# EAGLE design EAGLE_PCB_Design_Project1.1_DavidSalzmann (EAGLE 9.6.2)
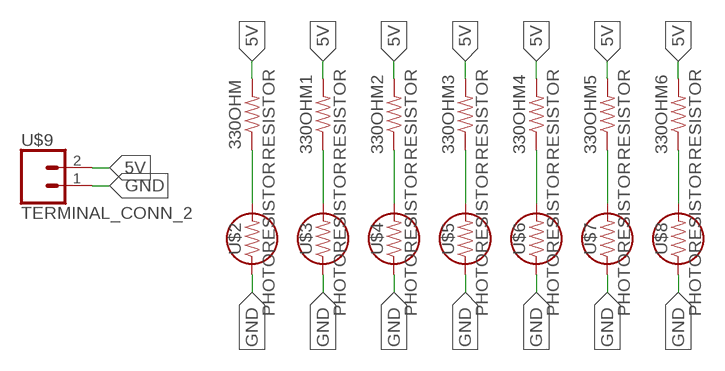
[diagram p0: schematic, sheet 1]

## Parts
330OHM  RESISTOR  [RESISTOR]
330OHM1  RESISTOR  [RESISTOR]
330OHM2  RESISTOR  [RESISTOR]
330OHM3  RESISTOR  [RESISTOR]
330OHM4  RESISTOR  [RESISTOR]
330OHM5  RESISTOR  [RESISTOR]
330OHM6  RESISTOR  [RESISTOR]
U$2  PHOTORESISTOR  [PHOTORESISTOR]
U$3  PHOTORESISTOR  [PHOTORESISTOR]
U$4  PHOTORESISTOR  [PHOTORESISTOR]
U$5  PHOTORESISTOR  [PHOTORESISTOR]
U$6  PHOTORESISTOR  [PHOTORESISTOR]
U$7  PHOTORESISTOR  [PHOTORESISTOR]
U$8  PHOTORESISTOR  [PHOTORESISTOR]
U$9  TERMINAL_CONN_2  [TERMINAL_CONN_2]

## Nets
5V: 330OHM1.2 330OHM2.2 330OHM3.2 330OHM4.2 330OHM5.2 330OHM6.2 330OHM.2 U$9.2
GND: U$2.P$1 U$3.P$1 U$4.P$1 U$5.P$1 U$6.P$1 U$7.P$1 U$8.P$1 U$9.1
N$9: 330OHM.1 U$2.P$2
N$10: 330OHM1.1 U$3.P$2
N$11: 330OHM2.1 U$4.P$2
N$12: 330OHM3.1 U$5.P$2
N$13: 330OHM4.1 U$6.P$2
N$14: 330OHM5.1 U$7.P$2
N$15: 330OHM6.1 U$8.P$2

## Library data of the parts
330OHM 330OHM1-330OHM6 = ECE5_WS:RESISTOR: This is a resistor
U$2-U$8 = ECE5_WS:PHOTORESISTOR: This is a photoresistor
U$9 = ECE5_WS:TERMINAL_CONN_2: 2 pin terminal block

## Board
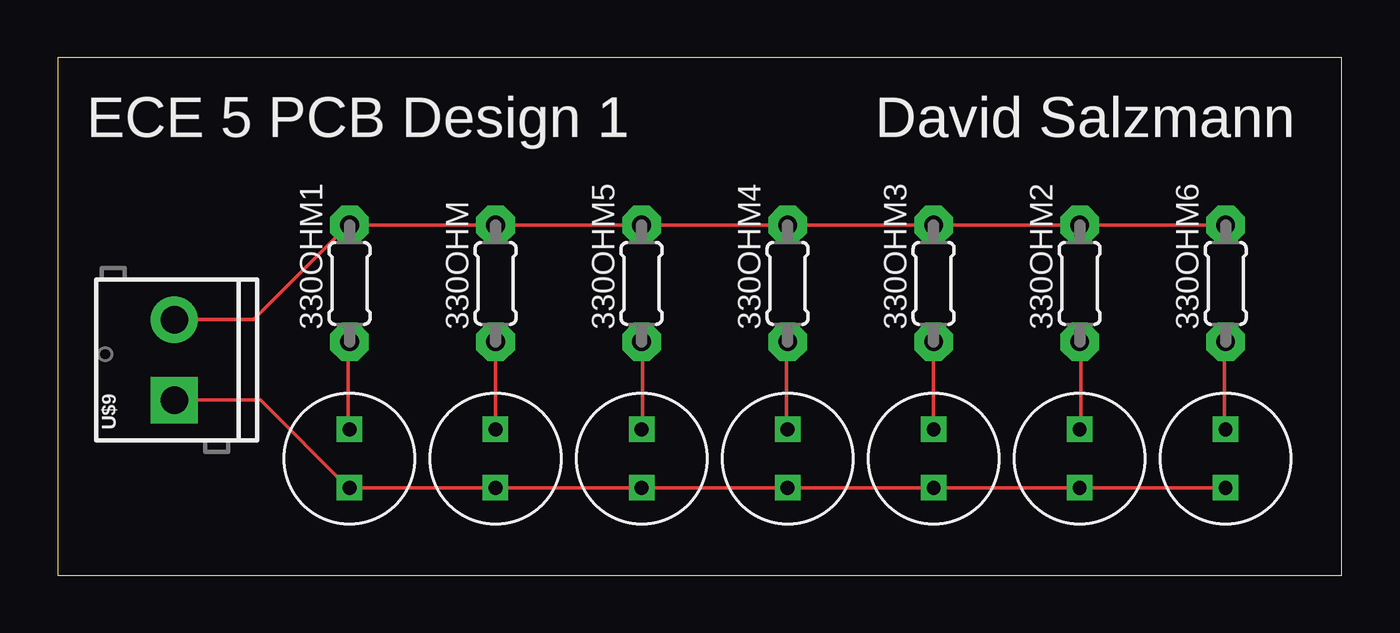
[diagram p1: board, top side]

Size 55.86 x 22.53 mm. Coordinates in mm from the lower left corner, seen from the top.
Outline: 0,0 55.86,0 55.86,22.53 0,22.53 0,0
Copper layers (1*16): Top 0.035mm / dielectric 1.5mm / Bottom 0.035mm
Design rules "default": minimum track width 6mil, minimum drill 0.35mm, track to track 6mil, track to pad 6mil, pad to pad 6mil, via to via 6mil, smd to smd 6mil, copper to edge 40mil, drill to drill 6mil, minimum pad ring 10mil, minimum via ring 8mil, stop-mask expansion 4mil, vias tented up to drill 0mil, thermal gap 10mil

### Footprints (pad centres in the part's own frame; a part is rotated, then mirrored left to right if it is on the bottom)
RESISTOR = drill 0.813 pad 1.676 octagon: 1 -2.54,0; 2 2.54,0
PHOTORESISTOR = drill 0.6 square: P$1 -1.27,0; P$2 1.27,0
TERMINAL_CONN_2 = drill 1.2 pad 2.032 square: 1 0,0 | drill 1.2 pad 2.032: 2 3.5,0

### Placement (x,y rotation side)
330OHM  19.05,12.7 90 top
330OHM1  12.7,12.7 90 top
330OHM2  44.45,12.7 90 top
330OHM3  38.1,12.7 90 top
330OHM4  31.75,12.7 90 top
330OHM5  25.4,12.7 90 top
330OHM6  50.8,12.7 90 top
U$2  19.05,5.08 90 top
U$3  12.7,5.08 90 top
U$4  44.45,5.08 90 top
U$5  38.1,5.08 90 top
U$6  31.75,5.08 90 top
U$7  25.4,5.08 90 top
U$8  50.8,5.08 90 top
U$9  5.08,7.62 90 top

### Tracks (layer width: path | path; a pad name or v marks a point on that pad's centre or on a via)
5V
  Top 0.152: U$9.2 5.18,11.12 8.53,11.12 12.65,15.24 330OHM1.2 330OHM.2 330OHM5.2 330OHM4.2 330OHM3.2 330OHM2.2 330OHM6.2
GND
  Top 0.152: U$9.1 8.84,7.62 12.65,3.81 U$3.P$1 U$2.P$1 U$7.P$1 U$6.P$1 U$5.P$1 U$4.P$1 U$8.P$1
N$9
  Top 0.152: 330OHM.1 U$2.P$2
N$10
  Top 0.152: U$3.P$2 12.65,6.4 12.65,10.06 330OHM1.1
N$11
  Top 0.152: U$4.P$2 44.5,6.4 44.5,10.06 330OHM2.1
N$12
  Top 0.152: 330OHM3.1 U$5.P$2
N$13
  Top 0.152: U$6.P$2 31.7,6.4 31.7,10.06 330OHM4.1
N$14
  Top 0.152: U$7.P$2 25.45,6.4 25.45,10.06 330OHM5.1
N$15
  Top 0.152: U$8.P$2 50.75,6.4 50.75,10.06 330OHM6.1

### Text on the board
tPlace: ECE 5 PCB Design 1 | David Salzmann